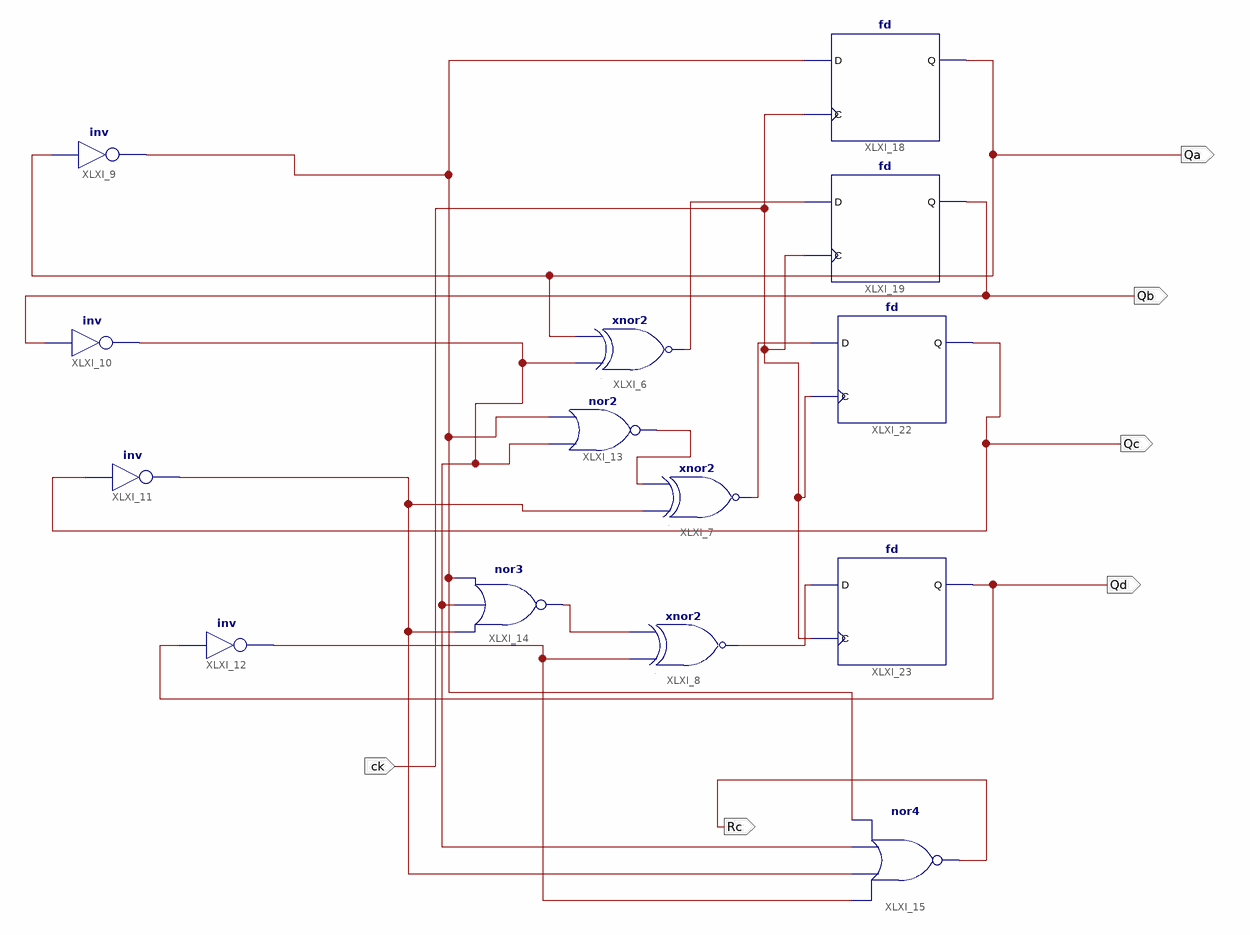
[diagram p0: schematic sheet 1]
// Xilinx ISE schematic Counter4b.sch (kintex7) as structural Verilog: 14 symbols, 6 ports
module Counter4b (
  input  ck,
  output Qa,
  output Qb,
  output Qc,
  output Qd,
  output Rc
);

  wire XLXN_24, XLXN_27, XLXN_31, XLXN_32, XLXN_33, XLXN_42, XLXN_45, XLXN_46, XLXN_47;

  xnor XLXI_6 (XLXN_45, XLXN_31, Qa);
  xnor XLXI_7 (XLXN_46, XLXN_32, XLXN_27);
  xnor XLXI_8 (XLXN_47, XLXN_42, XLXN_33);
  not XLXI_9 (XLXN_24, Qa);
  not XLXI_10 (XLXN_31, Qb);
  not XLXI_11 (XLXN_32, Qc);
  not XLXI_12 (XLXN_42, Qd);
  nor XLXI_13 (XLXN_27, XLXN_31, XLXN_24);
  nor XLXI_14 (XLXN_33, XLXN_32, XLXN_31, XLXN_24);
  nor XLXI_15 (Rc, XLXN_42, XLXN_32, XLXN_31, XLXN_24);
  fd XLXI_18 (.C(ck), .D(XLXN_24), .Q(Qa));
  fd XLXI_19 (.C(ck), .D(XLXN_45), .Q(Qb));
  fd XLXI_22 (.C(ck), .D(XLXN_46), .Q(Qc));
  fd XLXI_23 (.C(ck), .D(XLXN_47), .Q(Qd));
endmodule
